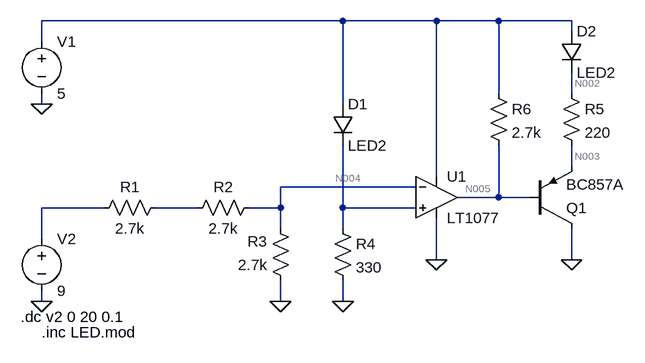
[diagram p0: schematic 9v_detector.asc]
9v_detector.asc, the LTspice schematic file:
Version 4
SHEET 1 880 680
WIRE -128 48 -592 48
WIRE 16 48 -128 48
WIRE 112 48 16 48
WIRE 224 48 112 48
WIRE 224 64 224 48
WIRE -592 80 -592 48
WIRE 112 160 112 48
WIRE 224 160 224 128
WIRE -592 176 -592 160
WIRE -128 176 -128 48
WIRE 224 272 224 240
WIRE 16 288 16 48
WIRE -16 304 -224 304
WIRE 112 320 112 240
WIRE 112 320 48 320
WIRE 160 320 112 320
WIRE -496 336 -592 336
WIRE -352 336 -416 336
WIRE -224 336 -224 304
WIRE -224 336 -272 336
WIRE -128 336 -128 240
WIRE -16 336 -128 336
WIRE -224 368 -224 336
WIRE -128 368 -128 336
WIRE -592 384 -592 336
WIRE 16 416 16 352
WIRE 224 416 224 368
WIRE -592 480 -592 464
WIRE -224 480 -224 448
WIRE -128 480 -128 448
FLAG -592 176 0
FLAG -592 480 0
FLAG 16 416 0
FLAG -224 480 0
FLAG -128 480 0
FLAG 224 416 0
SYMBOL voltage -592 64 R0
WINDOW 123 0 0 Left 2
WINDOW 39 0 0 Left 2
SYMATTR InstName V1
SYMATTR Value 5
SYMBOL voltage -592 368 R0
WINDOW 123 0 0 Left 2
WINDOW 39 0 0 Left 2
SYMATTR InstName V2
SYMATTR Value 9
SYMBOL pnp 160 368 M180
SYMATTR InstName Q1
SYMATTR Value BC857A
SYMBOL Opamps\\LT1077 16 256 R0
SYMATTR InstName U1
SYMBOL res -400 320 R90
WINDOW 0 0 56 VBottom 2
WINDOW 3 32 56 VTop 2
SYMATTR InstName R1
SYMATTR Value 2.7k
SYMBOL res -256 320 R90
WINDOW 0 0 56 VBottom 2
WINDOW 3 32 56 VTop 2
SYMATTR InstName R2
SYMATTR Value 2.7k
SYMBOL res -208 464 R180
WINDOW 0 36 76 Left 2
WINDOW 3 36 40 Left 2
SYMATTR InstName R3
SYMATTR Value 2.7k
SYMBOL res -144 352 R0
SYMATTR InstName R4
SYMATTR Value 330
SYMBOL res 208 144 R0
SYMATTR InstName R5
SYMATTR Value 220
SYMBOL res 96 144 R0
SYMATTR InstName R6
SYMATTR Value 2.7k
SYMBOL diode -144 176 R0
SYMATTR InstName D1
SYMATTR Value LED2
SYMBOL diode 208 64 R0
SYMATTR InstName D2
SYMATTR Value LED2
TEXT -624 504 Left 2 !.dc v2 0 20 0.1
TEXT -592 528 Left 2 !.inc LED.mod

The netlist it stands for:
* 9v_detector.asc
V1 N001 0 5
V2 N006 0 9
Q1 0 N005 N003 0 BC857A
XU1 N008 N004 N001 0 N005 LT1077  ; pins In+ In- V+ V- OUT
R1 N007 N006 2.7k
R2 N004 N007 2.7k
R3 0 N004 2.7k
R4 N008 0 330
R5 N002 N003 220
R6 N001 N005 2.7k
D1 N001 N008 LED2
D2 N001 N002 LED2
.model D D
.lib standard.dio
.model NPN NPN
.model PNP PNP
.lib standard.bjt
.dc v2 0 20 0.1
.inc LED.mod
.backanno
.end

* Results of the author's LTspice run, read from the files saved beside the schematic
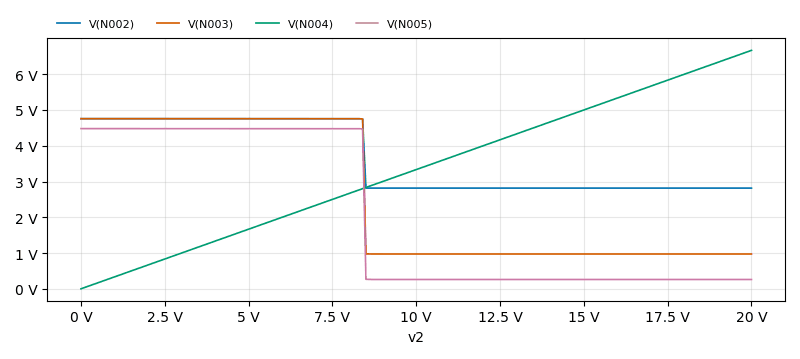
[diagram p1: DC transfer characteristic of 9v_detector.asc, plotted from the saved traces]
* DC transfer characteristic, 1 run:
*   V(N002): 4.757 V at v2=0 V, 2.816 V at v2=20 V, min 2.816 V, max 4.757 V
*   V(N003): 4.757 V at v2=0 V, 972.9 mV at v2=20 V, min 972.9 mV, max 4.757 V
*   V(N004): 17.09 µV at v2=0 V, 6.667 V at v2=20 V, min 17.09 µV, max 6.667 V
*   V(N005): 4.479 V at v2=0 V, 260.4 mV at v2=20 V, min 260.4 mV, max 4.479 V